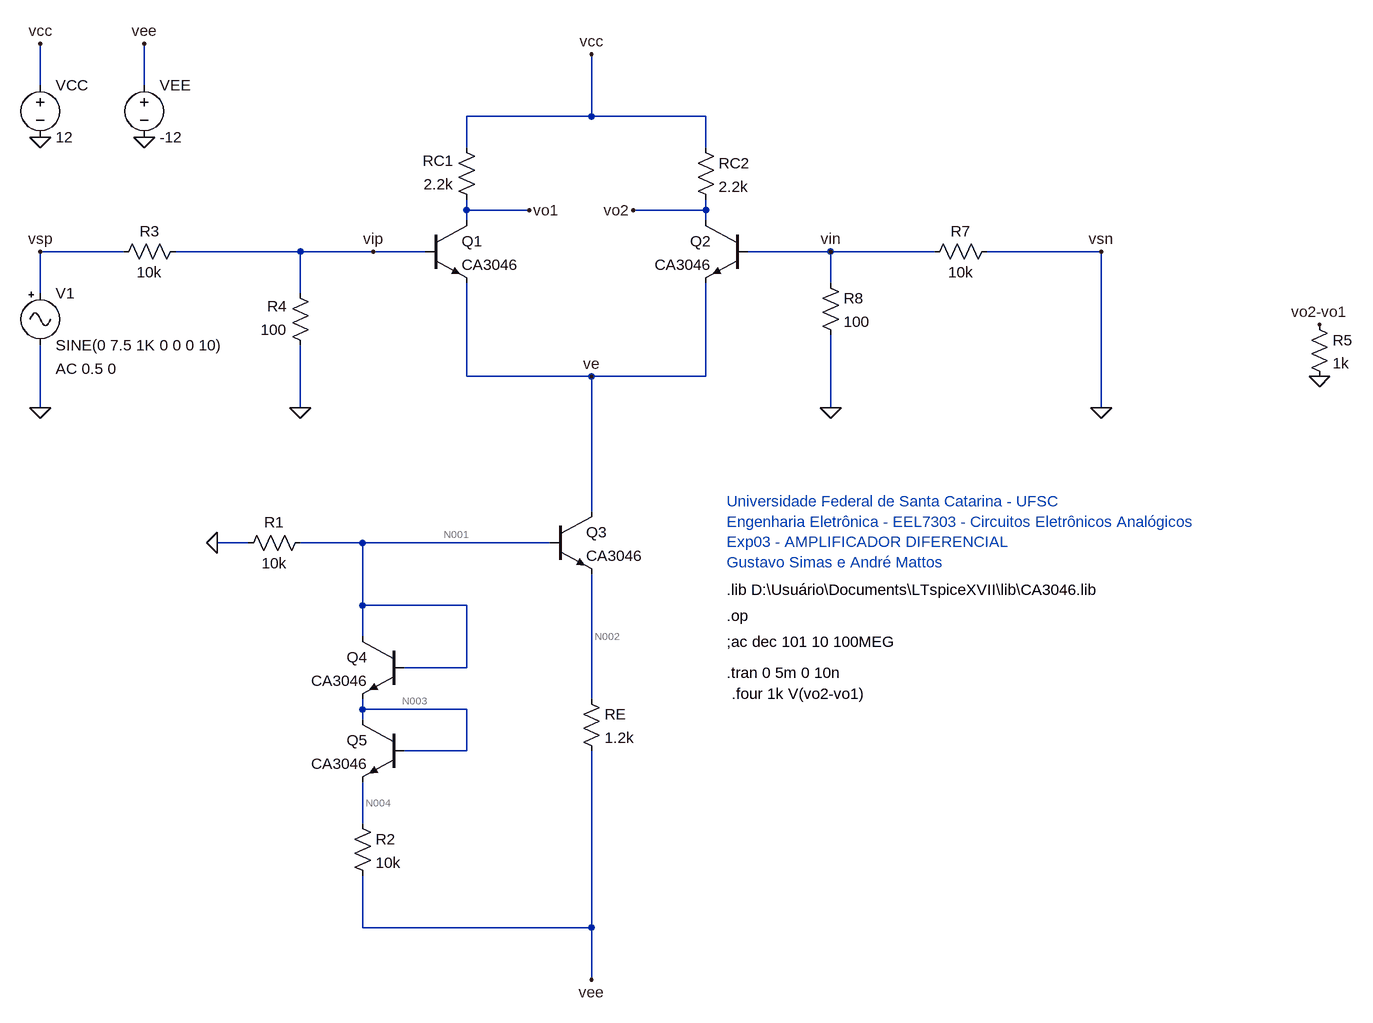
[diagram p0: schematic Lab03.asc]
Lab03.asc, the LTspice schematic file:
Version 4
SHEET 1 2544 1380
WIRE 512 -80 512 -144
WIRE 672 -80 672 -144
WIRE 1360 -32 1360 -128
WIRE 1360 -32 1168 -32
WIRE 1536 -32 1360 -32
WIRE 1168 16 1168 -32
WIRE 1536 16 1536 -32
WIRE 1168 112 1168 96
WIRE 1264 112 1168 112
WIRE 1536 112 1536 96
WIRE 1536 112 1424 112
WIRE 1168 128 1168 112
WIRE 1536 128 1536 112
WIRE 640 176 512 176
WIRE 912 176 720 176
WIRE 1024 176 912 176
WIRE 1104 176 1024 176
WIRE 1728 176 1600 176
WIRE 1888 176 1728 176
WIRE 2144 176 1968 176
WIRE 1728 224 1728 176
WIRE 512 240 512 176
WIRE 912 240 912 176
WIRE 1168 368 1168 224
WIRE 1360 368 1168 368
WIRE 1536 368 1536 224
WIRE 1536 368 1360 368
WIRE 512 416 512 320
WIRE 912 416 912 320
WIRE 1728 416 1728 304
WIRE 2144 416 2144 176
WIRE 1360 576 1360 368
WIRE 832 624 784 624
WIRE 1008 624 912 624
WIRE 1296 624 1008 624
WIRE 1008 720 1008 624
WIRE 1168 720 1008 720
WIRE 1008 768 1008 720
WIRE 1168 816 1168 720
WIRE 1168 816 1072 816
WIRE 1360 864 1360 672
WIRE 1008 880 1008 864
WIRE 1168 880 1008 880
WIRE 1008 896 1008 880
WIRE 1168 944 1168 880
WIRE 1168 944 1072 944
WIRE 1008 1056 1008 992
WIRE 1008 1216 1008 1136
WIRE 1360 1216 1360 944
WIRE 1360 1216 1008 1216
WIRE 1360 1296 1360 1216
FLAG 512 416 0
FLAG 912 416 0
FLAG 512 0 0
FLAG 672 0 0
FLAG 512 -144 vcc
FLAG 672 -144 vee
FLAG 1728 416 0
FLAG 2144 416 0
FLAG 1360 -128 vcc
FLAG 784 624 0
FLAG 1360 1296 vee
FLAG 1360 368 ve
FLAG 512 176 vsp
FLAG 2144 176 vsn
FLAG 1728 176 vin
FLAG 1264 112 vo1
FLAG 1424 112 vo2
FLAG 1024 176 vip
FLAG 2480 368 0
FLAG 2480 288 vo2-vo1
SYMBOL Misc\\signal 512 224 R0
WINDOW 123 24 132 Left 2
WINDOW 39 0 0 Left 0
SYMATTR Value2 AC 0.5 0
SYMATTR InstName V1
SYMATTR Value SINE(0 7.5 1K 0 0 0 10)
SYMBOL res 736 160 R90
WINDOW 0 0 56 VBottom 2
WINDOW 3 32 56 VTop 2
SYMATTR InstName R3
SYMATTR Value 10k
SYMBOL res 928 336 R180
WINDOW 0 36 76 Left 2
WINDOW 3 36 40 Left 2
SYMATTR InstName R4
SYMATTR Value 100
SYMBOL res 1184 112 R180
WINDOW 0 36 76 Left 2
WINDOW 3 36 40 Left 2
SYMATTR InstName RC1
SYMATTR Value 2.2k
SYMBOL npn 1104 128 R0
SYMATTR InstName Q1
SYMATTR Value CA3046
SYMBOL res 1520 0 R0
SYMATTR InstName RC2
SYMATTR Value 2.2k
SYMBOL voltage 512 -96 R0
WINDOW 123 0 0 Left 0
WINDOW 39 0 0 Left 0
SYMATTR InstName VCC
SYMATTR Value 12
SYMBOL voltage 672 -96 R0
WINDOW 123 0 0 Left 0
WINDOW 39 0 0 Left 0
SYMATTR InstName VEE
SYMATTR Value -12
SYMBOL npn 1600 128 M0
SYMATTR InstName Q2
SYMATTR Value CA3046
SYMBOL res 1712 208 R0
SYMATTR InstName R8
SYMATTR Value 100
SYMBOL res 1984 160 R90
WINDOW 0 0 56 VBottom 2
WINDOW 3 32 56 VTop 2
SYMATTR InstName R7
SYMATTR Value 10k
SYMBOL npn 1296 576 R0
SYMATTR InstName Q3
SYMATTR Value CA3046
SYMBOL npn 1072 896 M0
SYMATTR InstName Q5
SYMATTR Value CA3046
SYMBOL npn 1072 768 M0
SYMATTR InstName Q4
SYMATTR Value CA3046
SYMBOL res 992 1040 R0
SYMATTR InstName R2
SYMATTR Value 10k
SYMBOL res 1344 848 R0
SYMATTR InstName RE
SYMATTR Value 1.2k
SYMBOL res 928 608 R90
WINDOW 0 0 56 VBottom 2
WINDOW 3 32 56 VTop 2
SYMATTR InstName R1
SYMATTR Value 10k
SYMBOL res 2464 272 R0
SYMATTR InstName R5
SYMATTR Value 1k
TEXT 1568 560 Left 2 ;Universidade Federal de Santa Catarina - UFSC\nEngenharia Eletrônica - EEL7303 - Circuitos Eletrônicos Analógicos\nExp03 - AMPLIFICADOR DIFERENCIAL\nGustavo Simas e André Mattos
TEXT 1568 696 Left 2 !.lib D:\\Usuário\\Documents\\LTspiceXVII\\lib\\CA3046.lib
TEXT 1568 736 Left 2 !.op
TEXT 1568 776 Left 2 !;ac dec 101 10 100MEG
TEXT 1568 824 Left 2 !.tran 0 5m 0 10n
TEXT 1576 856 Left 2 !.four 1k V(vo2-vo1)

The netlist it stands for:
* Lab03.asc
V1 vsp 0 SINE(0 7.5 1K 0 0 0 10) AC 0.5 0
R3 vip vsp 10k
R4 0 vip 100
RC1 vo1 vcc 2.2k
Q1 vo1 vip ve 0 CA3046
RC2 vcc vo2 2.2k
VCC vcc 0 12
VEE vee 0 -12
Q2 vo2 vin ve 0 CA3046
R8 vin 0 100
R7 0 vin 10k
Q3 ve N001 N002 0 CA3046
Q5 N003 N003 N004 0 CA3046
Q4 N001 N001 N003 0 CA3046
R2 N004 vee 10k
RE N002 vee 1.2k
R1 N001 0 10k
R5 vo2-vo1 0 1k
.model NPN NPN
.model PNP PNP
.lib standard.bjt
* Universidade Federal de Santa Catarina - UFSC
* Engenharia Eletrônica - EEL7303 - Circuitos Eletrônicos Analógicos
* Exp03 - AMPLIFICADOR DIFERENCIAL
* Gustavo Simas e André Mattos
.lib D:\Usuário\Documents\LTspiceXVII\lib\CA3046.lib
.op
;ac dec 101 10 100MEG
.tran 0 5m 0 10n
.four 1k V(vo2-vo1)
.backanno
.end

* Results of the author's LTspice run, read from the files saved beside the schematic
* Operating Point, zero values left out:
*   V(vip) = -2.091 mV
*   V(vo1) = 6.844 V
*   V(vcc) = 12 V
*   V(ve) = -678.9 mV
*   V(vo2) = 6.844 V
*   V(vee) = -12 V
*   V(vin) = -2.091 mV
*   V(n001) = -5.577 V
*   V(n002) = -6.274 V
*   V(n003) = -6.215 V
*   V(n004) = -6.853 V
*   Ic(Q4) = 509.2 µA
*   Ib(Q4) = 5.472 µA
*   Ie(Q4) = -514.7 µA
*   Ic(Q5) = 509.2 µA
*   Ib(Q5) = 5.472 µA
*   Ie(Q5) = -514.7 µA
*   Ic(Q3) = 4.729 mA
*   Ib(Q3) = 42.99 µA
*   Ie(Q3) = -4.772 mA
*   Ic(Q2) = 2.343 mA
*   Ib(Q2) = 21.12 µA
*   Ie(Q2) = -2.365 mA
*   Ic(Q1) = 2.343 mA
*   Ib(Q1) = 21.12 µA
*   Ie(Q1) = -2.365 mA
*   I(R1) = -557.7 µA
*   I(Re) = 4.772 mA
*   I(R2) = 514.7 µA
*   I(R7) = 209.1 nA
*   I(R8) = -20.91 µA
*   I(Rc2) = 2.343 mA
*   I(Rc1) = -2.343 mA
*   I(R4) = 20.91 µA
*   I(R3) = -209.1 nA
*   I(Vee) = 5.287 mA
*   I(Vcc) = -4.687 mA
*   I(V1) = -209.1 nA
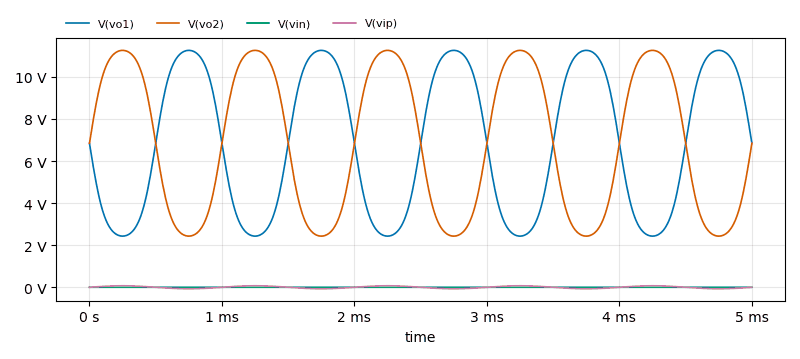
[diagram p1: Transient Analysis of Lab03.asc, plotted from the saved traces]
* Transient Analysis, 1 run:
*   V(vo1): min 2.43 V, max 11.26 V, average 6.846 V, rms 7.647 V, last 6.845 V
*   V(vo2): min 2.43 V, max 11.26 V, average 6.846 V, rms 7.647 V, last 6.844 V
*   V(vin): min -4.007 mV, max -340 µV, average -2.142 mV, rms 2.564 mV, last -2.089 mV
*   V(vip): min -74.6 mV, max 70.25 mV, average -2.143 mV, rms 51.15 mV, last -2.093 mV
* From the log:
*   N-Period=1
*   Fourier components of V(vo2-vo1)
*   DC component:0
*   Harmonic  Frequency   Fourier   Normalized   Phase    Normalized
*    Number     [Hz]     Component   Component  [degree]  Phase [deg]
*       1     1.000e+03  0.000e+00  -1.#IOe+00      0.00°      0.00°
*       2     2.000e+03  0.000e+00  -1.#IOe+00      0.00°      0.00°
*       3     3.000e+03  0.000e+00  -1.#IOe+00      0.00°      0.00°
*       4     4.000e+03  0.000e+00  -1.#IOe+00      0.00°      0.00°
*       5     5.000e+03  0.000e+00  -1.#IOe+00      0.00°      0.00°
*       6     6.000e+03  0.000e+00  -1.#IOe+00      0.00°      0.00°
*       7     7.000e+03  0.000e+00  -1.#IOe+00      0.00°      0.00°
*       8     8.000e+03  0.000e+00  -1.#IOe+00      0.00°      0.00°
*       9     9.000e+03  0.000e+00  -1.#IOe+00      0.00°      0.00°
*   Total Harmonic Distortion: -1.#IND00%(0.000000%)